# EAGLE design Compass_one side (EAGLE 7.2.0)
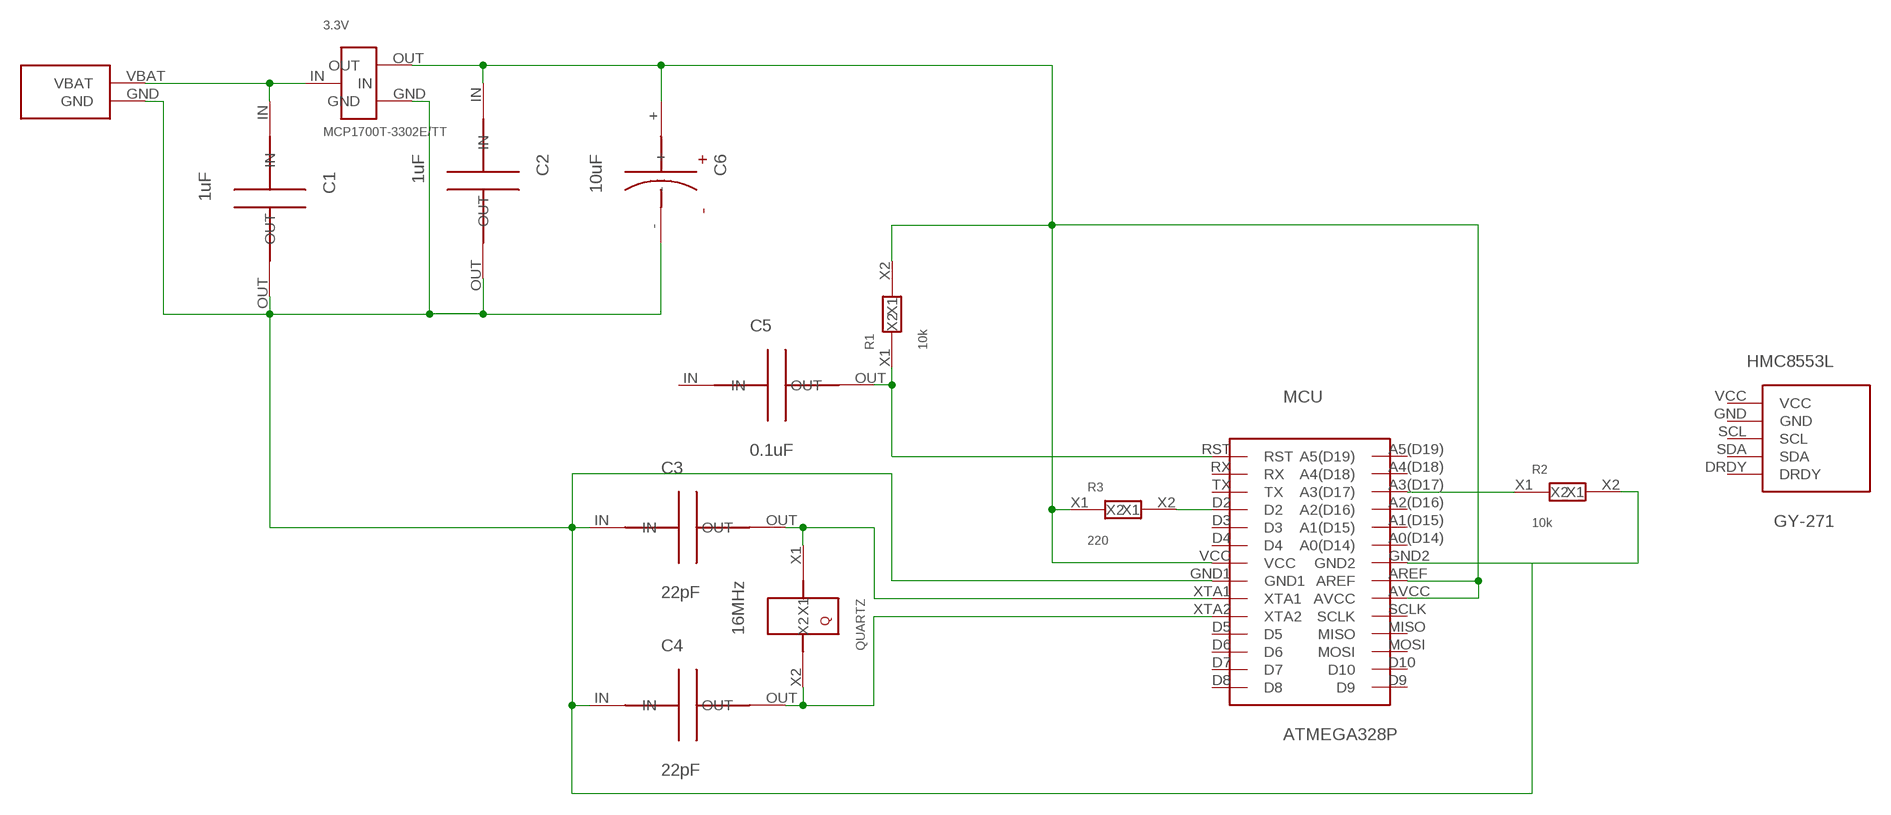
[diagram p0: schematic, sheet 1]

## Parts
3.3V  MCP1700T-3302E/TT  [MCP1700T-3302E/TT]
C1  1uF  C_CER_5MM  [C_CER_5MM]
C2  1uF  C_CER_5MM  [C_CER_5MM]
C3  22pF  C_CER_5MM  [C_CER_5MM]
C4  22pF  C_CER_5MM  [C_CER_5MM]
C5  0.1uF  C_CER_5MM  [C_CER_5MM]
C6  10uF  C_ELT_2MM  [C_ELT_2MM]
HMC8553L  GY-271  [GY-271]
MCU  ATMEGA328P  [DIP28]
QUARTZ  16MHz  Q_16  [Q_16]
R1  10k  R_6X2  [R_6X2]
R2  10k  R_6X2  [R_6X2]
R3  220  R_6X2  [R_6X2]
U$6  BAT_PLUG  [BAT_PLUG]

## Nets
A3: MCU.A3(D17) R2.X1
N$1: 3.3V.OUT C2.IN C6.+ MCU.AREF MCU.AVCC MCU.VCC R1.X2 R3.X1
N$2: 3.3V.GND C1.OUT C2.OUT C3.IN C4.IN C6.- MCU.GND1 MCU.GND2 R2.X2 U$6.GND
N$5: 3.3V.IN C1.IN U$6.VBAT
N$7: C3.OUT MCU.XTA1 QUARTZ.X1
N$8: C4.OUT MCU.XTA2 QUARTZ.X2
N$13: C5.OUT MCU.RST R1.X1
N$14: MCU.D2 R3.X2
Unconnected: C5.IN HMC8553L.DRDY HMC8553L.GND HMC8553L.SCL HMC8553L.SDA HMC8553L.VCC MCU.A0(D14) MCU.A1(D15) MCU.A2(D16) MCU.A4(D18) MCU.A5(D19) MCU.D3 MCU.D4 MCU.D5 MCU.D6 MCU.D7 MCU.D8 MCU.D9 MCU.D10 MCU.MISO MCU.MOSI MCU.RX MCU.SCLK MCU.TX

## Library data of the parts
3.3V = MyDuino:MCP1700T-3302E/TT
C1-C5 = MyDuino:C_CER_5MM
C6 = MyDuino:C_ELT_2MM
HMC8553L = MyDuino:GY-271
MCU = MyDuino:ATMEGA328P
QUARTZ = MyDuino:Q_16
R1-R3 = MyDuino:R_6X2
U$6 = MyDuino:BAT_PLUG

## Board
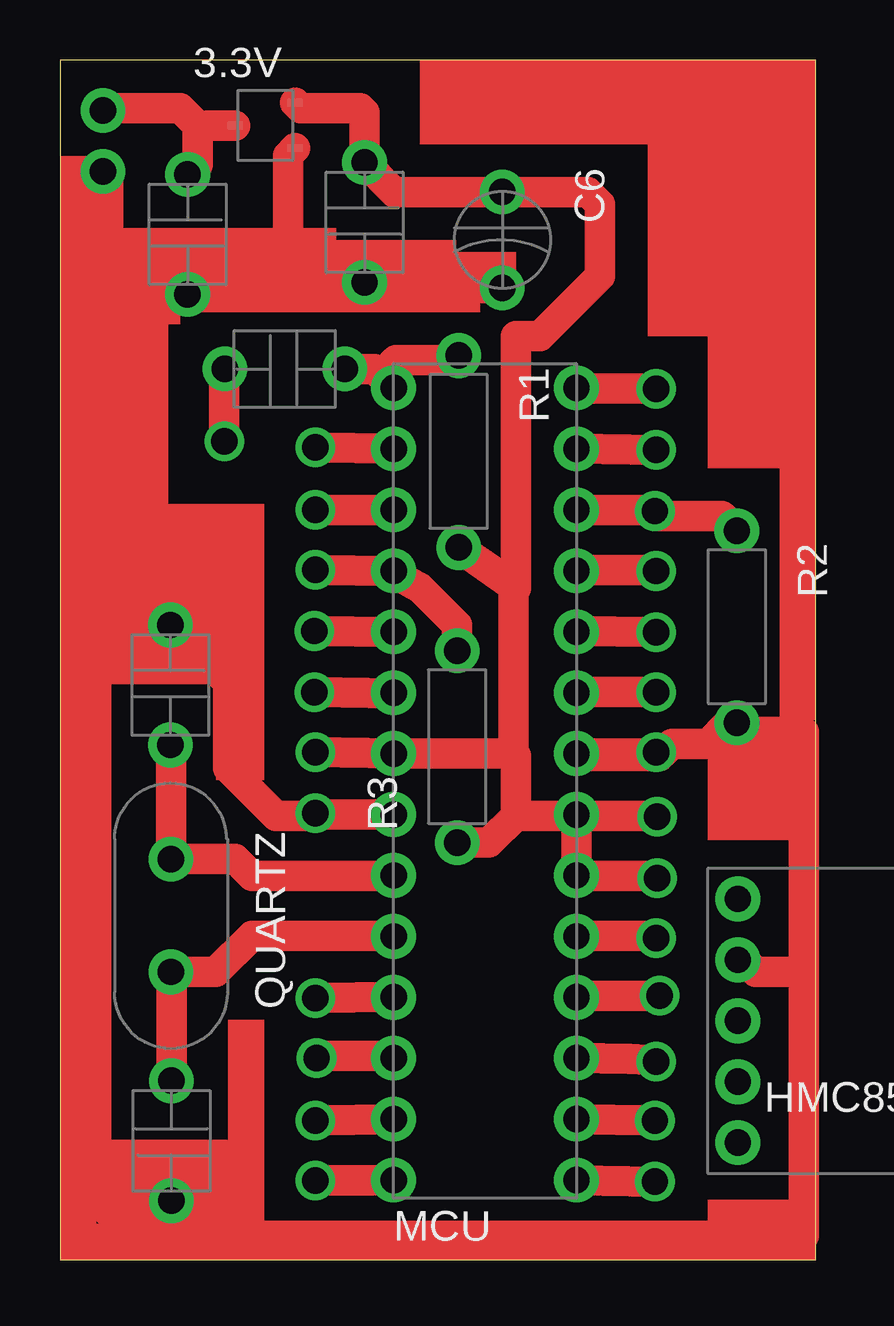
[diagram p1: board, top side]

Size 31.5 x 50 mm. Coordinates in mm from the lower left corner, seen from the top.
Outline: 0,0 31.5,0 31.5,50 0,50 0,0
Copper layers (1*16): Top 0.035mm / dielectric 1.5mm / Bottom 0.035mm
Design rules "default *": minimum track width 40mil, minimum drill 24mil, track to track 20mil, track to pad 20mil, pad to pad 20mil, via to via 20mil, smd to smd 20mil, copper to edge 40mil, drill to drill 8mil, minimum pad ring 15mil, minimum via ring 8mil, stop-mask expansion 4mil, vias tented up to drill 0mil, thermal gap 10mil

### Footprints (pad centres in the part's own frame; a part is rotated, then mirrored left to right if it is on the bottom)
MCP1700T-3302E/TT = smd 0.61 x 0.305: GND 1.25,-0.95; IN -1.25,0; OUT 1.25,0.95
C_CER_5MM = drill 1.1: IN -2.5,0; OUT 2.5,0
C_ELT_2MM = drill 1.1: + -2,0; - 2,0
GY-271 = drill 1.1: DRDY 0,5.08; GND 0,-2.54; SCL 0,0; SDA 0,2.54; VCC 0,-5.08
DIP28 = drill 1.1: A0(D14) 5.08,7.62; A1(D15) 5.08,10.16; A2(D16) 5.08,12.7; A3(D17) 5.08,15.24; A4(D18) 5.08,17.78; A5(D19) 5.08,20.32; AREF 5.08,2.54; AVCC 5.08,0; D2 -2.54,12.7; D3 -2.54,10.16; D4 -2.54,7.62; D5 -2.54,-5.08; D6 -2.54,-7.62; D7 -2.54,-10.16; D8 -2.54,-12.7; D9 5.08,-12.7; D10 5.08,-10.16; GND1 -2.54,2.54; GND2 5.08,5.08; MISO 5.08,-5.08; MOSI 5.08,-7.62; RST -2.54,20.32; RX -2.54,17.78; SCLK 5.08,-2.54; TX -2.54,15.24; VCC -2.54,5.08; XTA1 -2.54,0; XTA2 -2.54,-2.54
Q_16 = drill 1.1: X1 -2.35,0; X2 2.35,0
R_6X2 = drill 1.1: X1 -4,0; X2 4,0
BAT_PLUG = drill 1.1: GND 0,0; VBAT 0,2.54

### Placement (x,y rotation side)
3.3V  8.56,47.27 0 top
C1  5.32,42.73 270 top
C2  12.7,43.23 270 top
C3  4.6,23.95 270 top
C4  4.65,4.95 90 top
C5  9.37,37.12 0 top
C6  18.44,42.5 270 top
HMC8553L  28.26,9.95 180 top
MCU  16.45,16.01 0 top
QUARTZ  4.63,14.34 270 top
R1  16.62,33.68 270 top
R2  28.22,26.38 270 top
R3  16.56,21.38 90 top
U$6  1.79,45.35 0 top

### Tracks (layer width: path | path; a pad name or v marks a point on that pad's centre or on a via)
A0  (via drill 1.1)
  other vias: 24.85,23.65
A1  (via drill 1.1)
  other vias: 24.85,26.15
A2  (via drill 1.1)
  other vias: 24.85,28.7
A3
  Top 1.27: MCU.A3(D17) 24.75,31.25 25,31 27.6,31 R2.X1
A4  (via drill 1.1)
  other vias: 24.85,33.75
A5  (via drill 1.1)
  other vias: 24.85,36.3
AREF  (via drill 1.1)
  other vias: 24.9,15.9
AVCC  (via drill 1.1)
  other vias: 24.9,18.45
D0  (via drill 1.1)
  other vias: 10.65,33.85
D1  (via drill 1.1)
  other vias: 10.65,31.25
D2  (via drill 1.1)
  other vias: 10.65,28.75
D3  (via drill 1.1)
  other vias: 10.6,26.2
D4  (via drill 1.1)
  other vias: 10.6,23.65
D5  (via drill 1.1)
  other vias: 10.65,10.9
D6  (via drill 1.1)
  other vias: 10.7,8.4
D7  (via drill 1.1)
  other vias: 10.65,5.8
D8  (via drill 1.1)
  other vias: 10.65,3.3
D9  (via drill 1.1)
  other vias: 24.8,3.25
D10  (via drill 1.1)
  other vias: 24.8,5.8
D11  (via drill 1.1)
  other vias: 24.85,8.25
D12  (via drill 1.1)
  other vias: 25,11
D13  (via drill 1.1)
  other vias: 24.85,13.4
GND1  (via drill 1.1)
  other vias: 10.65,18.6
GND2  (via drill 1.1)
  other vias: 24.85,21.15
N$1
  Top 1.27: MCU.AVCC MCU.AREF 21.48,18.5 19,18.5 | R3.X1 17.88,17.38 19,18.5 | MCU.VCC 18.91,21.09 | 18.91,21.09 19,21 19,18.5 | 18.91,21.09 18.91,27.91 19,28 | 19,28 18.3,28.5 R1.X2 18.82,28.18 19,28 | 19,28 19,38.5 20,38.5 22.5,41 22.5,44 22,44.5 C6.+ 13.93,44.5 C2.IN 12.7,47.8 12.5,48 10.03,48 3.3V.OUT
N$2
  Top 1.27: MCU.GND1 10.55,18.55 10.5,18.5 9,18.5 7,20.5 7,24.05 C3.IN 3.55,27.5 2,27.5 | R2.X2 27.88,22.38 27,21.5 | 25,21 21.62,21 MCU.GND2 24.91,21.09 25,21 | C6.- 12.93,40.5 C2.OUT | C2.OUT 9.73,40.73 9.5,40.5 9.5,46.01 3.3V.GND | C2.OUT 5.82,40.73 C1.OUT | C1.OUT 2.27,40.23 2,40.5 2,45.14 U$6.GND | C1.OUT 2.23,40.23 2,40 2,27.5 | C4.IN 1.55,2.45 | 1.55,2.45 1.5,2.5 1.5,27 2,27.5 | 25,21 25.5,21.5 27,21.5 | 27,21.5 28,21.5 28.5,22 31,22 31,12 | 31,12 31,1 3,1 1.55,2.45 | 31,12 29,12 28.5,12.5
N$3
  Top 1.27: 3,2 4,2
N$4
  Top 1.27: 21.45,33.8 24.95,33.75
N$5
  Top 1.27: 3.3V.IN 5.73,47.27 | 5.73,47.27 5,48 1.9,48 U$6.VBAT | 5.73,47.27 5.73,45.64 C1.IN
N$6  (via drill 1.1)
  other vias: 24.8,31.2
N$7
  Top 1.27: MCU.XTA1 8,16 7.31,16.69 QUARTZ.X1 4.63,21.42 C3.OUT
N$8
  Top 1.27: MCU.XTA2 13.88,13.5 8,13.5 6.49,11.99 QUARTZ.X2 4.65,11.97 C4.OUT
N$9
  Top 1.27: 21.55,36.3 24.85,36.3
N$10
  Top 1.27: 21.45,28.75 24.95,28.75
N$11
  Top 1.27: 21.5,26.2 24.85,26.15
N$12
  Top 1.27: 14.05,33.8 10.55,33.85
N$13
  Top 1.27: C5.OUT 13.12,37.12 MCU.RST 13.91,37.41 14,37.5 16.44,37.5 R1.X1
N$14
  Top 1.27: R3.X2 16.56,26.44 15,28 14.12,28.5 MCU.D2
N$15
  Top 1.27: 14,31.25 10.65,31.25
N$16
  Top 1.27: 14,28.7 10.6,28.75
N$17
  Top 1.27: 13.95,26.15 10.6,26.2
N$18
  Top 1.27: 14,23.6 10.6,23.65
N$19
  Top 1.27: 14,21.1 10.55,21.15
N$20
  Top 1.27: 14,10.95 10.6,10.9
N$21
  Top 1.27: 21.5,13.5 25,13.5
N$22
  Top 1.27: 21.5,16 25,16
N$23
  Top 1.27: 21.5,18.5 25,18.5
N$24
  Top 1.27: 21.45,23.65 24.9,23.65
N$25
  Top 1.27: 21.5,11 25,11
N$26
  Top 1.27: 14,8.5 10.5,8.5
N$27
  Top 1.27: 14.05,5.85 10.55,5.8
N$28
  Top 1.27: 13.95,3.3 10.6,3.3
N$29
  Top 1.27: 21.5,8.4 arc-4 24.85,8.3
N$30
  Top 1.27: 21.45,5.85 24.85,5.8
N$31
  Top 1.27: 21.5,3.3 24.85,3.25
N$32
  Top 1.27: 6.85,37.1 6.85,34.1
REF  (via drill 1.1)
  other vias: 6.85,34.1
VCC  (via drill 1.1)
  other vias: 10.65,21.15
(copper drawn outside any net)
  shapes: Top area x23